# Altium schematic sheet Reverse_Voltage_Protect.SchDoc
size A
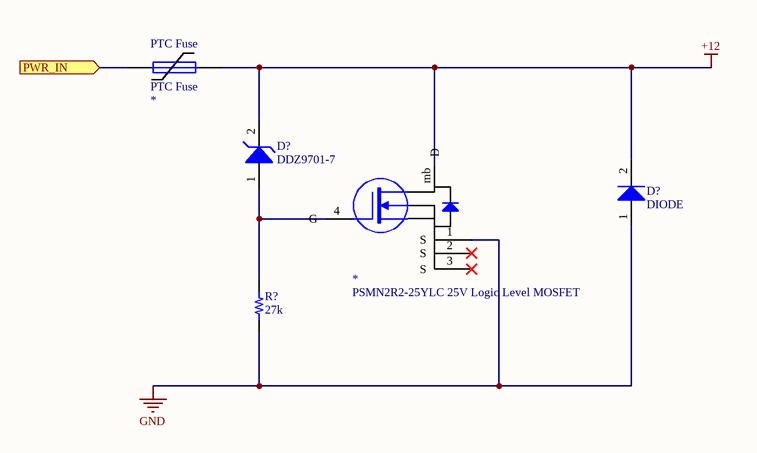
[diagram p0: Reverse_Voltage_Protect.SchDoc]

## Parts
(Parts that share a designator on the sheet are numbered #1, #2 ... from top to bottom, then left to right.)
*  PSMN2R2-25YLC 25V Logic Level MOSFET  [LFPAK-SO8]
D?#1  DDZ9701-7  [SODFL350X115-2M]
D?#2  DIODE  [TO-277.PcbLib]
PTC_Fuse  PTC Fuse  [PTC Fuse 2920/07351]
R?  value 27k  [RES 0805/2012]  (hidden comment: Resistor 27k 0805 1/10W 1%)

## Ports
PWR_IN (in)

## Nets
+12: *.mb(D) D?#1.2(K) D?#2.2(K) PTC_Fuse.2
GND: *.1(S) D?#2.1(A) R?.1
PWR_IN: PTC_Fuse.1 ; port PWR_IN
Net*_4: *.4(G) D?#1.1(A) R?.2

Not connected (* = marked no-connect by the designer): * 2(S)* 3(S)*

## Library data of the parts
* = 3: N-Channel 25V 100A (Tc) 106W (Tc) Surface Mount LFPAK56, Power-SO8; Manufacturer_id: 6; MfrPartNo: PSMN2R2-25YLC,115; idFETs: 3; Drawer_id: 1; Value: N_Channel; Rds_On: 2.5mOhm; Vgs(typ): 10V; Vgs(Max): 20V; Created_By: Nick; Name: PSMN2R2; Vdss: 25V; Num_Circuits: 1; Id: 100A; Package: LFPAK-SO8; Link: https://www.digikey.com/product-detail/en/nexperia-usa-inc/PSMN2R2-25YLC115/1727-5299-1-ND/2674299; ComponentLink1Description: Datasheet; ComponentLink1URL: https://assets.nexperia.com/documents/data-sheet/PSMN2R2-25YLC.pdf; Supplier1: Digi-Key; Supplier1PartNo: 1727-5299-1-ND
D?#1 = 10: Zener Diode 14V 500mW ±5% Surface Mount SOD-123; Manufacturer_id: 8; idDiode: 10; Drawer_id: 1; Value: 14Vz; MfrPartNo: DDZ9701-7; Name: DDZ9701; Type: Zener; Num_Circuits: 1; Power: 500mW; Package: SOD-123; Link: https://www.digikey.com/product-detail/en/diodes-incorporated/DDZ9701-7/DDZ9701-7DICT-ND/3877402; ComponentLink1Description: Datasheet; ComponentLink1URL: https://www.diodes.com/assets/Datasheets/ds30410.pdf; Supplier1: Digi-Key; Supplier1PartNo: DDZ9701-7DICT-ND
D?#2 = 11: Manufacturer_id: 1; idDiode: 11; Name: FSV20100V; Value: 20 A; Type: Schottky; Drawer_id: 1; Package: TO-277; MfrPartNo: FSV20100V; Link: https://www.digikey.com/product-detail/en/on-semiconductor/FSV20100V/FSV20100VCT-ND/5306682; ComponentLink1Description: Datasheet; ComponentLink1URL: https://www.fairchildsemi.com/datasheets/FS/FSV20100V.pdf; Supplier1PartNo: FSV20100VCT-ND
PTC_Fuse = 6: Fuse; Manufacturer_id: 1; idFuse: 6; Name: 2920L500/16MR; I_hold: 5 A; I_trip: 10 A; I_max: 40 A; V_max: 16 V; Published: 8-Jun-2000; LatestRevisionDate: 17-Jul-2002; LatestRevisionNote: Re-released for DXP Platform.; PackageReference: PIN-W2/E2.8; Publisher: Altium Limited; PackageDescription: Thru-Hole; 2 Leads; I-hold: *; Drawer_id: 1
R? = 539: Manufacturer_id: 1; idResistor: 539; Name: Res_27k_0805_1/10W_1%; Created_By: Nick Mah; Supplier 1: Digi-Key; Drawer_id: 1; Tolerance: 1%; Power: 1/10W; Package: 0805; ComponentLink1Description: Datasheet; Created_Date: 2018-10-20